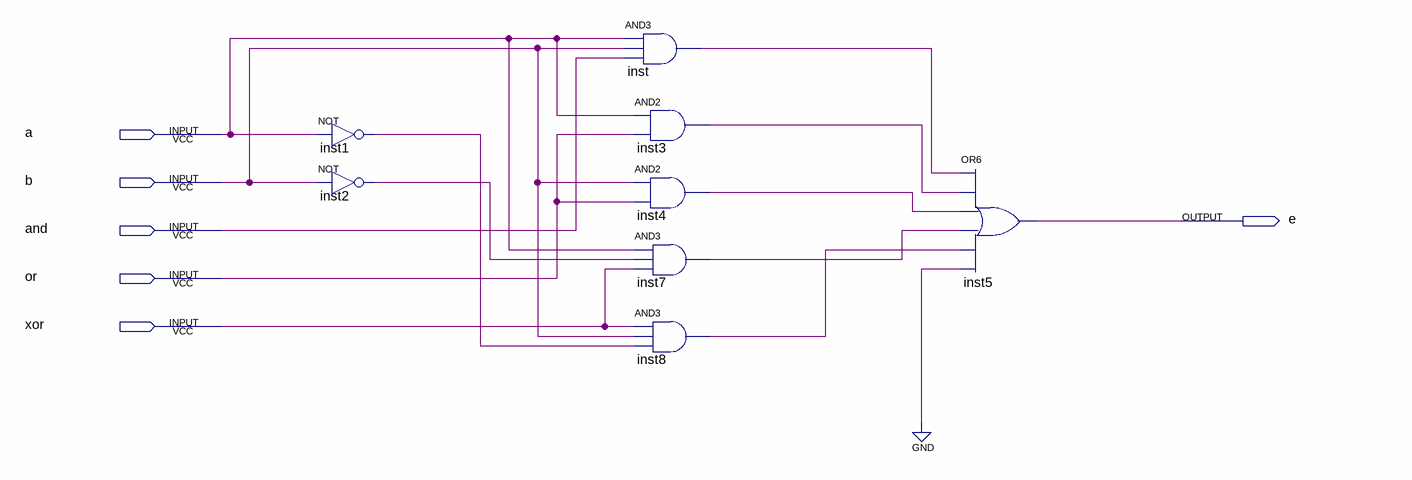
[diagram p0: schematic sheet]
// Quartus schematic 1.bdf as structural Verilog: 8 symbols, 6 pins
module \1  (
  input  a,
  input  b,
  input  \and ,
  input  \or ,
  input  \xor ,
  output e
);

  wire inst1_out, inst2_out, inst3_out, inst4_out, inst7_out, inst8_out, inst_out;

  not inst1 (inst1_out, a);
  not inst2 (inst2_out, b);
  and inst (inst_out, a, b, \and );
  and inst3 (inst3_out, a, \or );
  and inst4 (inst4_out, b, \or );
  and inst7 (inst7_out, a, inst2_out, \xor );
  and inst8 (inst8_out, \xor , b, inst1_out);
  or inst5 (e, inst_out, inst3_out, inst4_out, inst7_out, inst8_out, 1'b0);
endmodule
